# EAGLE schematic draftAccelTemp (EAGLE 9.2.2)
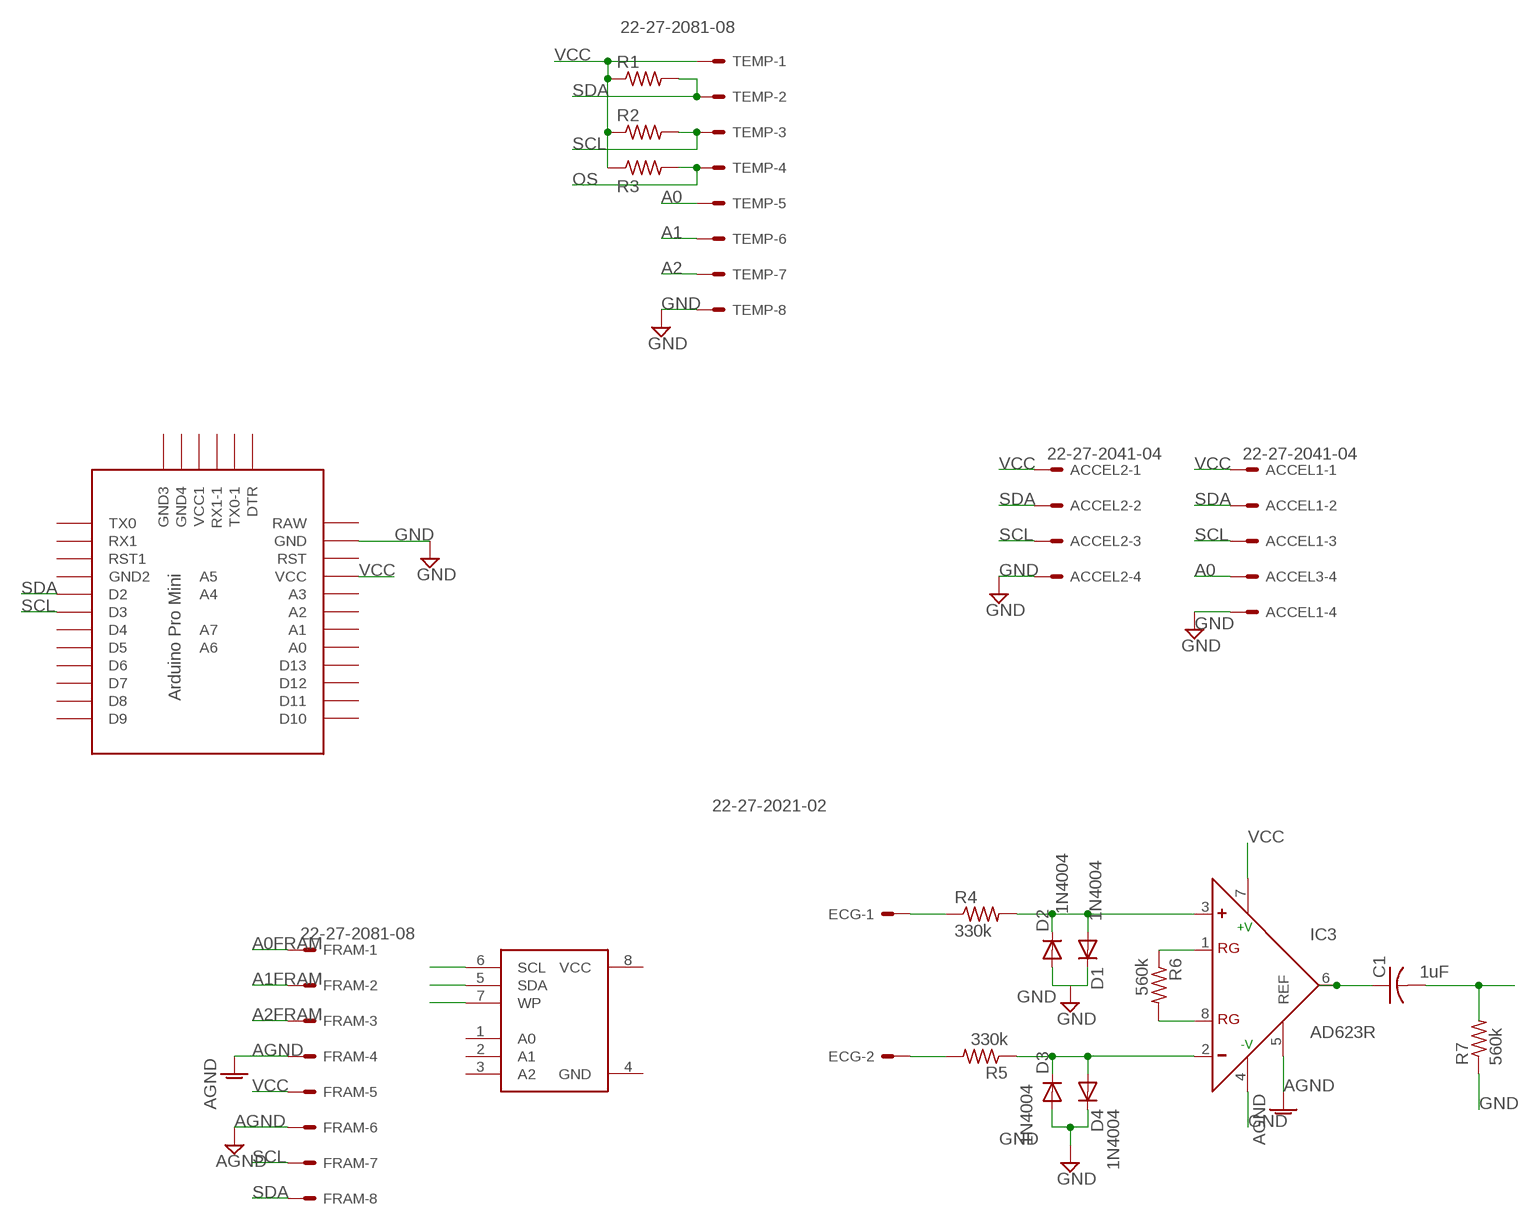
[diagram p0: schematic, sheet 1]

## Parts
ACCEL1  22-27-2041-04  [6410-04]
ACCEL2  22-27-2041-04  [6410-04]
ACCEL3  22-27-2041-04  [6410-04]
C1  1uF  C-USC0805  [C0805]
D1  1N4004  [DO41-10]
D2  1N4004  [DO41-10]
D3  1N4004  [DO41-10]
D4  1N4004  [DO41-10]
ECG  22-27-2021-02  [6410-02]
FRAM  22-27-2081-08  [6410-08]
IC3  AD623R  [SO8]
R1  R-US_R0805  [R0805]
R2  R-US_R0805  [R0805]
R3  R-US_R0805  [R0805]
R4  330k  R-US_R0805  [R0805]
R5  330k  R-US_R0805  [R0805]
R6  560k  R-US_R0805  [R0805]
R7  560k  R-US_R0805  [R0805]
TEMP  22-27-2081-08  [6410-08]
U2  MB85RC256VPF-G-JNERE2  [SOIC8]
U$1  PRO-MINI-2  [PRO-MINI-2]

## Nets
A0: ACCEL3.4 TEMP.5
A0FRAM: FRAM.1
A1: TEMP.6
A1FRAM: FRAM.2
A2: TEMP.7
A2FRAM: FRAM.3
AGND: FRAM.4 FRAM.6 IC3.5(REF)
GND: ACCEL1.4 ACCEL2.4 C1.2 D1.C D2.A D3.A D4.C IC3.4(-V) R7.1 R7.2 TEMP.8 U$1.GND
N$1: ECG.1 R4.1
N$2: D3.C D4.A IC3.2(-) R5.1
N$3: U2.6(SCL)
N$4: ECG.2 R5.2
N$5: D1.A D2.C IC3.3(+) R4.2
N$6: C1.1 IC3.6(OUT)
N$7: IC3.8(RG) R6.2
N$8: IC3.1(RG) R6.1
N$9: U2.5(SDA)
N$10: U2.7(WP)
OS: R3.2 TEMP.4
SCL: ACCEL1.3 ACCEL2.3 FRAM.7 R2.2 TEMP.3 U$1.D3
SDA: ACCEL1.2 ACCEL2.2 FRAM.8 R1.2 TEMP.2 U$1.D2
VCC: ACCEL1.1 ACCEL2.1 FRAM.5 IC3.7(+V) R1.1 R2.1 R3.1 TEMP.1 U$1.VCC
Unconnected: ACCEL3.1 ACCEL3.2 ACCEL3.3 U2.1(A0) U2.2(A1) U2.3(A2) U2.4(GND) U2.8(VCC) U$1.A0 U$1.A1 U$1.A2 U$1.A3 U$1.A4 U$1.A5 U$1.A6 U$1.A7 U$1.D4 U$1.D5 U$1.D6 U$1.D7 U$1.D8 U$1.D9 U$1.D10 U$1.D11 U$1.D12 U$1.D13 U$1.DTR U$1.GND1(GND2) U$1.GND2(GND3) U$1.GND3(GND4) U$1.RAW U$1.RST U$1.RST1 U$1.RX1 U$1.RX1-1 U$1.TX0 U$1.TX0-1 U$1.VCC1

## Library data of the parts
ACCEL1-ACCEL3 = con-molex:22-?-04: CONNECTOR wire to board 2.54 mm (.1 inch) pitch header; MF: MOLEX; OC_FARNELL: unknown; OC_NEWARK: unknown
C1 = rcl:C-US: CAPACITOR, American symbol; SPICEPREFIX: C
D1-D4 = diode:1N4004: DIODE general purpose rectifier, 1 A
ECG = con-molex:22-?-02: CONNECTOR wire to board 2.54 mm (.1 inch) pitch header; MF: MOLEX; OC_FARNELL: unknown; OC_NEWARK: unknown
FRAM TEMP = con-molex:22-?-08: CONNECTOR wire to board 2.54 mm (.1 inch) pitch header; MF: MOLEX; OC_FARNELL: unknown; OC_NEWARK: unknown
IC3 = analog-devices:AD623: Single-Supply, Rail-to-Rail, Low Cost Instrumentation Amplifier Source: http://www.analog.com/static/imported-files/data_sheets/AD623.pdf; MPN: AD623ARZ.; OC_FARNELL: 9426213; OC_NEWARK: 31M4186
R1-R7 = rcl:R-US_: RESISTOR, American symbol; SPICEPREFIX: R
U2 = Custom Parts:MB85RC256VPF-G-JNERE2
U$1 = Arduino-clone:PRO-MINI-2: Arduino Pro Mini Layout 2 Sparkfun.com